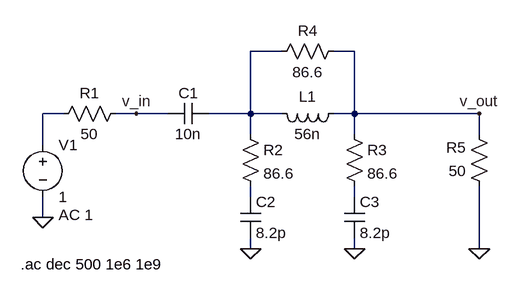
[diagram p0: schematic original.asc]
original.asc, the LTspice schematic file:
Version 4
SHEET 1 880 680
WIRE 352 32 304 32
WIRE 464 32 432 32
WIRE 16 128 -16 128
WIRE 128 128 96 128
WIRE 176 128 128 128
WIRE 304 128 304 32
WIRE 304 128 240 128
WIRE 352 128 304 128
WIRE 464 128 464 32
WIRE 464 128 432 128
WIRE 656 128 464 128
WIRE 304 160 304 128
WIRE 464 160 464 128
WIRE 656 160 656 128
WIRE -16 176 -16 128
WIRE 304 256 304 240
WIRE 464 256 464 240
WIRE -16 288 -16 256
WIRE 304 336 304 320
WIRE 464 336 464 320
WIRE 656 336 656 240
FLAG -16 288 0
FLAG 304 336 0
FLAG 464 336 0
FLAG 656 336 0
FLAG 656 128 v_out
FLAG 128 128 v_in
SYMBOL cap 240 112 R90
WINDOW 0 0 32 VBottom 2
WINDOW 3 32 32 VTop 2
SYMATTR InstName C1
SYMATTR Value 10n
SYMBOL voltage -16 160 R0
WINDOW 123 24 124 Left 2
WINDOW 39 0 0 Left 0
SYMATTR InstName V1
SYMATTR Value 1
SYMATTR Value2 AC 1
SYMBOL res 112 112 R90
WINDOW 0 0 56 VBottom 2
WINDOW 3 32 56 VTop 2
SYMATTR InstName R1
SYMATTR Value 50
SYMBOL res 288 144 R0
SYMATTR InstName R2
SYMATTR Value 86.6
SYMBOL res 448 144 R0
SYMATTR InstName R3
SYMATTR Value 86.6
SYMBOL ind 448 112 R90
WINDOW 0 5 56 VBottom 2
WINDOW 3 32 56 VTop 2
SYMATTR InstName L1
SYMATTR Value 56n
SYMBOL cap 288 256 R0
SYMATTR InstName C2
SYMATTR Value 8.2p
SYMBOL cap 448 256 R0
SYMATTR InstName C3
SYMATTR Value 8.2p
SYMBOL res 448 16 R90
WINDOW 0 0 56 VBottom 2
WINDOW 3 32 56 VTop 2
SYMATTR InstName R4
SYMATTR Value 86.6
SYMBOL res 672 256 R180
WINDOW 0 36 76 Left 2
WINDOW 3 36 40 Left 2
SYMATTR InstName R5
SYMATTR Value 50
TEXT -50 360 Left 2 !.ac dec 500 1e6 1e9

The netlist it stands for:
* original.asc
C1 N001 v_in 10n
V1 N002 0 1 AC 1
R1 v_in N002 50
R2 N001 N003 86.6
R3 v_out N004 86.6
L1 v_out N001 56n
C2 N003 0 8.2p
C3 N004 0 8.2p
R4 v_out N001 86.6
R5 0 v_out 50
.ac dec 500 1e6 1e9
.backanno
.end